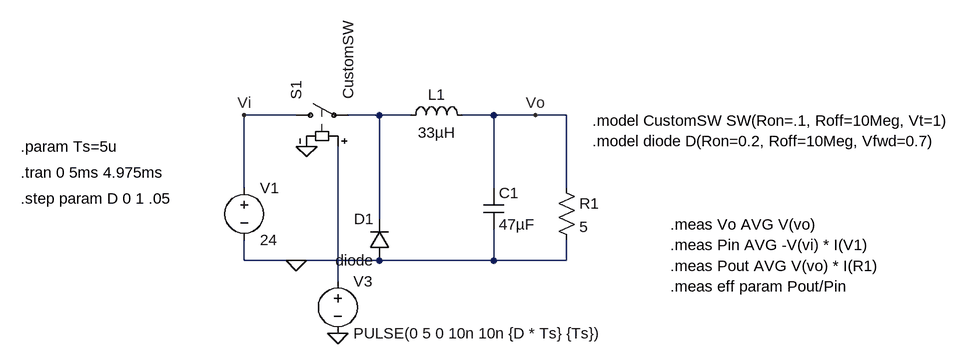
[diagram p0: schematic HW4q5.asc]
HW4q5.asc, the LTspice schematic file:
Version 4.1
SHEET 1 1120 680
WIRE 48 160 -32 160
WIRE 176 160 128 160
WIRE 224 160 176 160
WIRE 352 160 304 160
WIRE 416 160 352 160
WIRE 464 160 416 160
WIRE -32 272 -32 160
WIRE 352 272 352 160
WIRE 464 272 464 160
WIRE 176 320 176 160
WIRE -32 384 -32 352
WIRE 48 384 -32 384
WIRE 176 384 48 384
WIRE 352 384 352 336
WIRE 352 384 176 384
WIRE 464 384 464 352
WIRE 464 384 352 384
WIRE 112 416 112 208
FLAG 48 384 0
FLAG 112 496 0
FLAG 416 160 Vo
FLAG 64 208 0
FLAG -32 160 Vi
SYMBOL voltage -32 256 R0
WINDOW 123 0 0 Left 0
WINDOW 39 0 0 Left 0
SYMATTR InstName V1
SYMATTR Value 24
SYMBOL res 448 256 R0
SYMATTR InstName R1
SYMATTR Value 5
SYMBOL cap 336 272 R0
SYMATTR InstName C1
SYMATTR Value 47µF
SYMBOL ind 208 176 R270
WINDOW 0 32 56 VTop 2
WINDOW 3 5 56 VBottom 2
SYMATTR InstName L1
SYMATTR Value 33µH
SYMBOL voltage 112 400 R0
WINDOW 123 0 0 Left 0
WINDOW 39 0 0 Left 0
SYMATTR InstName V3
SYMATTR Value PULSE(0 5 0 10n 10n {D * Ts} {Ts})
SYMBOL sw 32 160 R270
SYMATTR InstName S1
SYMATTR Value CustomSW
SYMBOL diode 192 384 R180
WINDOW 0 24 64 Left 2
WINDOW 3 24 0 Left 2
SYMATTR InstName D1
SYMATTR Value diode
TEXT -376 208 Left 2 !.param Ts=5u
TEXT -376 248 Left 2 !.tran 0 5ms 4.975ms
TEXT -376 288 Left 2 !.step param D 0 1 .05
TEXT 504 168 Left 2 !.model CustomSW SW(Ron=.1, Roff=10Meg, Vt=1)
TEXT 504 200 Left 2 !.model diode D(Ron=0.2, Roff=10Meg, Vfwd=0.7)
TEXT 624 328 Left 2 !.meas Vo AVG V(vo)
TEXT 624 424 Left 2 !.meas eff param Pout/Pin
TEXT 624 392 Left 2 !.meas Pout AVG V(vo) * I(R1)
TEXT 624 360 Left 2 !.meas Pin AVG -V(vi) * I(V1)

The netlist it stands for:
* HW4q5.asc
V1 Vi 0 24
R1 Vo 0 5
C1 Vo 0 47µF
L1 N001 Vo 33µH
V3 N002 0 PULSE(0 5 0 10n 10n {D * Ts} {Ts})
S1 Vi N001 N002 0 CustomSW
D1 0 N001 diode
.model D D
.lib standard.dio
.param Ts=5u
.tran 0 5ms 4.975ms
.step param D 0 1 .05
.model CustomSW SW(Ron=.1, Roff=10Meg, Vt=1)
.model diode D(Ron=0.2, Roff=10Meg, Vfwd=0.7)
.meas Vo AVG V(vo)
.meas eff param Pout/Pin
.meas Pout AVG V(vo) * I(R1)
.meas Pin AVG -V(vi) * I(V1)
.backanno
.end